# EasyEDA Pro project OptoGrid_V0.05.epro, schematic OptoGrid_Programmer_V0.05
Board Name: OptoGrid_Programmer_V0.05; Create Date: 2025-08-04; Page Name: Sheet_1; Project Name: OptoGrid_V0.05; Schematic Name: OptoGrid_Programmer_V0.05; Update Date: 2025-09-04; Company: 嘉立创EDA; Drawed: Fukui (Daniel) Yang; Page Size: A4; Version: V1.0
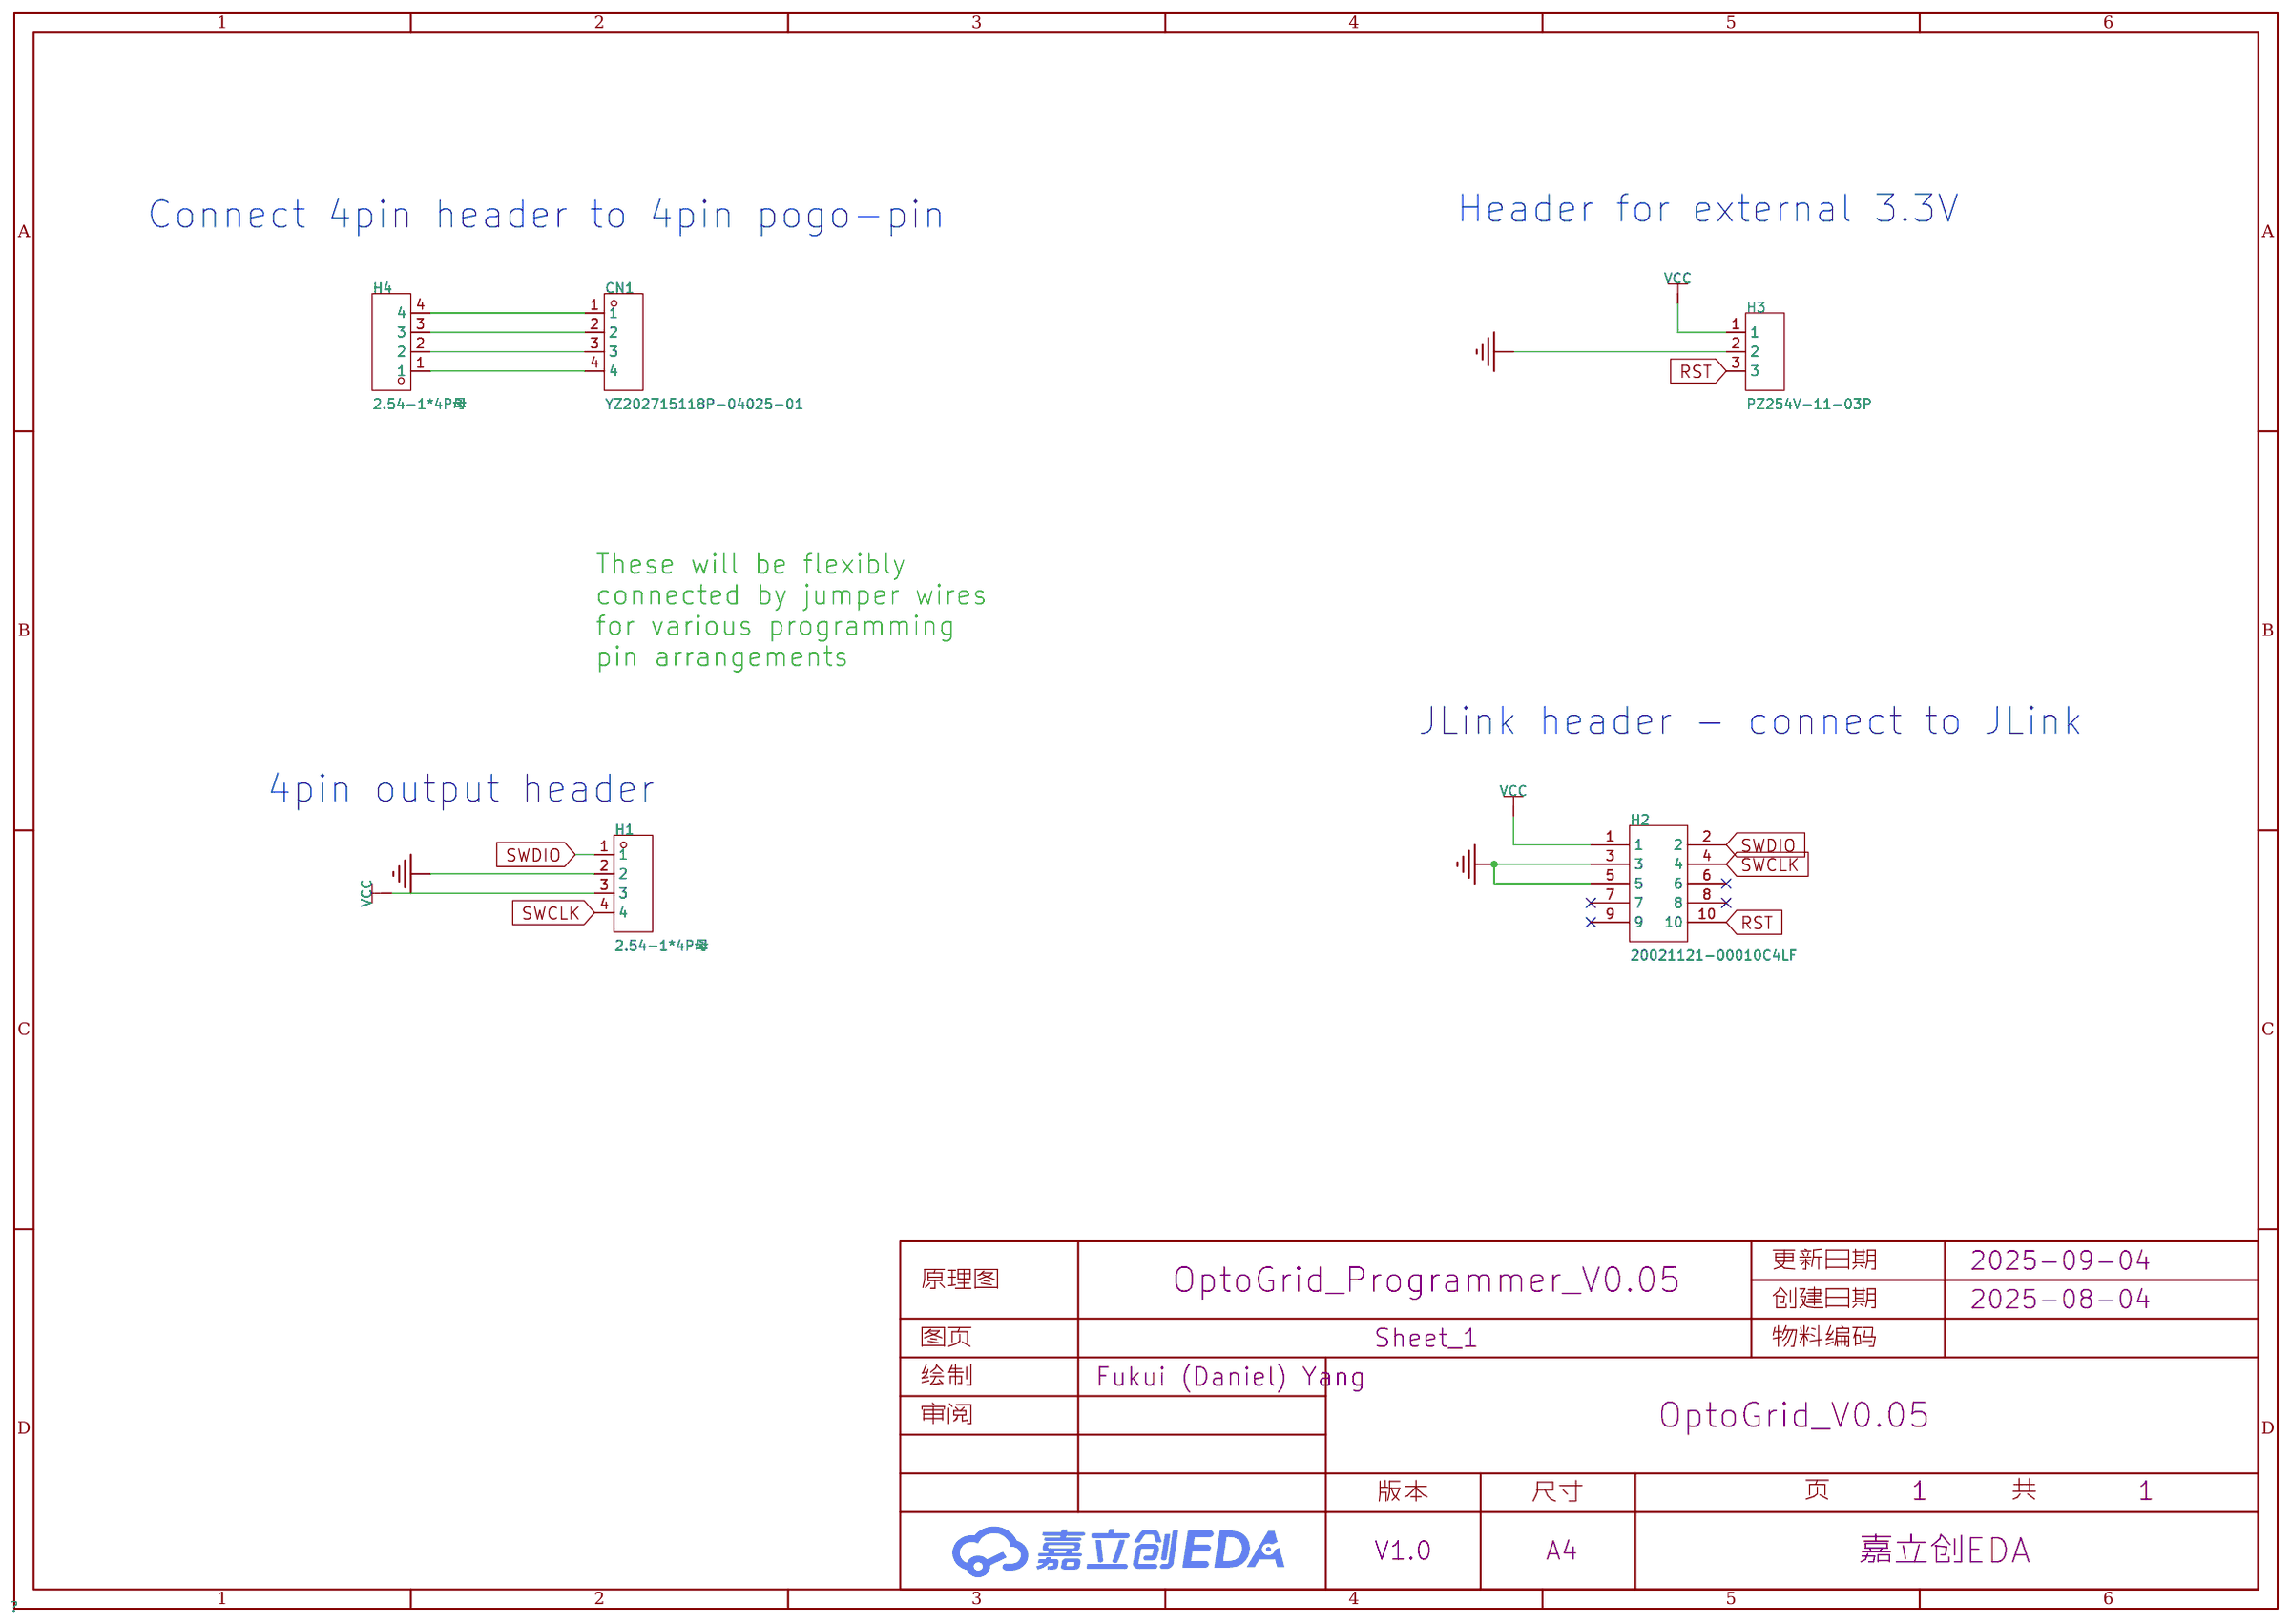
[diagram p3: schematic sheet]

## Parts
CN1  YZ202715118P-04025-01  [BAT-TH_4P-P2.50_YZ202715118P-04025-01]
H1  2.54-1*4P母  [HDR-TH_4P-P2.54-V-F]
H2  20021121-00010C4LF  [HDR-SMD_10P-P1.27-V-M-R2-C5-S1.27-LS5.5]
H3  PZ254V-11-03P  [HDR-TH_3P-P2.54-V-M]
H4  2.54-1*4P母  [HDR-TH_4P-P2.54-V-F]

## Library data of the parts
CN1 = YZ202715118P-04025-01: 类型:弹簧顶针(POGO PIN);PIN位数:四PIN位;间距:2.5mm;全长/全高:11.8mm;工作高度:8.8mm;接触电阻:50mΩ;弹性寿命:10000次;额定电流:2A;额定电压:12V;触头材质:黄铜;触头镀层:金;工作温度范围:-20℃~+70℃;; LCSC Part Name: 4pin插件弹簧顶针连接器; Supplier Part: C5200688; Manufacturer: Xinyangze(鑫扬泽); JLCPCB Part Class: 扩展库; Datasheet: https://atta.szlcsc.com/upload/public/pdf/source/20221019/0919E530BBF6DFF73CECBA7E447C2B8F.pdf; Supplier: LCSC; Type: 弹簧顶针(POGO PIN); Number of Pins: 四PIN位; Pitch: 2.5mm; Overall Length/Height: 11.8mm; Operational Height: 8.8mm; Contact Resistance: 50mΩ; Elastic Life: 10000次; Rated Current: 2A; Rated Voltage: 12V; Contact Material: 黄铜; Contact Plating: 金; Operating Temperature Range: -20℃~+70℃
H1 H4 = 2.54-1*4P母: 插孔结构:1x4P;间距:2.54mm;行距:-;圆孔/方孔:方孔;安装类型:直插;排数:单排;总孔位数:4P;额定电流:3A;额定电压:-;插孔方向:顶部;塑高:-;触头材质:青铜;触头镀层:-;工作温度范围:-40℃~+105℃;焊接温度(最大值):-;; LCSC Part Name: 间距:2.54mm 1x4P 直插; Supplier Part: C2718488; Manufacturer: BOOMELE(博穆精密); Supplier Footprint: 插件,P=2.54mm; JLCPCB Part Class: Extended Part; Datasheet: https://atta.szlcsc.com/upload/public/pdf/source/20210301/C2718488_F4427B881E42CAA8DDB0B1C12B3A522C.pdf; Supplier: LCSC; Holes Structure: 1x4P; Pitch: 2.54mm; Circular Hole / Square Hole: 方孔; Mounting Type: 直插; Number of Rows: 单排; Number of Holes: 4P; Current Rating (Max): 3A; Holes Direction: 顶部; Contact Material: 青铜; Operating Temperature Range: -40℃~+105℃
H2 = 20021121-00010C4LF: 插针结构:2x5P;间距:1.27mm;行距:1.27mm;圆针/方针:-;安装类型:立贴;排数:双排;总PIN位数:10P;额定电流:-;额定电压:-;配合针长度:-;塑高:-;触头材质:铜合金;触头镀层:-;颜色:黑色;; LCSC Part Name: 间距:1.27mm 2x5P 立贴; Supplier Part: C150517; Manufacturer: Amphenol; Supplier Footprint: SMD,P=1.27mm; JLCPCB Part Class: 扩展库; Datasheet: https://atta.szlcsc.com/upload/public/pdf/source/20180619/C239061_0A91EF97BE287FE12DFBF9350A11B160.pdf; Supplier: LCSC; Pin Structure: 2x5P; Pitch: 1.27mm; Row Spacing: 1.27mm; Mounting Type: 立贴; Number of Rows: 双排; Number of Pins: 10P; Contact Material: 铜合金; Color: 黑色
H3 = PZ254V-11-03P: 插针结构:1x3P;间距:2.54mm;行距:-;圆针/方针:方针;安装方式:直插;排数:单排;总PIN位数:3P;额定电流:3A;额定电压:250V;配合针长度:6mm;塑高:2.5mm;端接针长度:3mm;工作温度:-40℃~+105℃;颜色:黑色;; LCSC Part Name: 1x3P 间距:2.54mm 方针 直插; Supplier Part: C2937625; Manufacturer: XFCN(兴飞); Supplier Footprint: 插件,P=2.54mm; JLCPCB Part Class: 扩展库; Datasheet: https://atta.szlcsc.com/upload/public/pdf/source/20200309/C492402_8335C3D49C4E4C618838D59BB1D024C1.pdf; Supplier: LCSC; Pin Structure: 1x3P; Pitch: 2.54mm; Circluar Pins/Square Pins: 方针; Mounting Type: 直插; Number of Rows: 单排; Number of Pins: 3P; Current Rating: 3A; Voltage Rating (Max): 250V; Length of Mating Pin: 6mm; Insulation Height: 2.5mm; Length of End Connection Pin: 3mm; Operating Temperature: -40℃~+105℃; Color: 黑色

## Nets
GND: H1.2 H2.3 H2.5 H3.2
VCC: H1.3 H2.1 H3.1
RST: H2.10 H3.3
SWCLK: H1.4 H2.4
SWDIO: H1.1 H2.2
$1N2057: CN1.1 H4.4
$1N2061: CN1.2 H4.3
$1N2065: CN1.3 H4.2
$1N2069: CN1.4 H4.1

Not connected (* = marked no-connect by the designer): H2 6* 7* 8* 9*

## Notes on the sheet
- Connect 4pin header to 4pin pogo-pin
- Header for external 3.3V
- These will be flexibly
  connected by jumper wires
  for various programming
  pin arrangements
- JLink header - connect to JLink
- 4pin output header
